# EAGLE design SArduino (EAGLE 9.6.2)
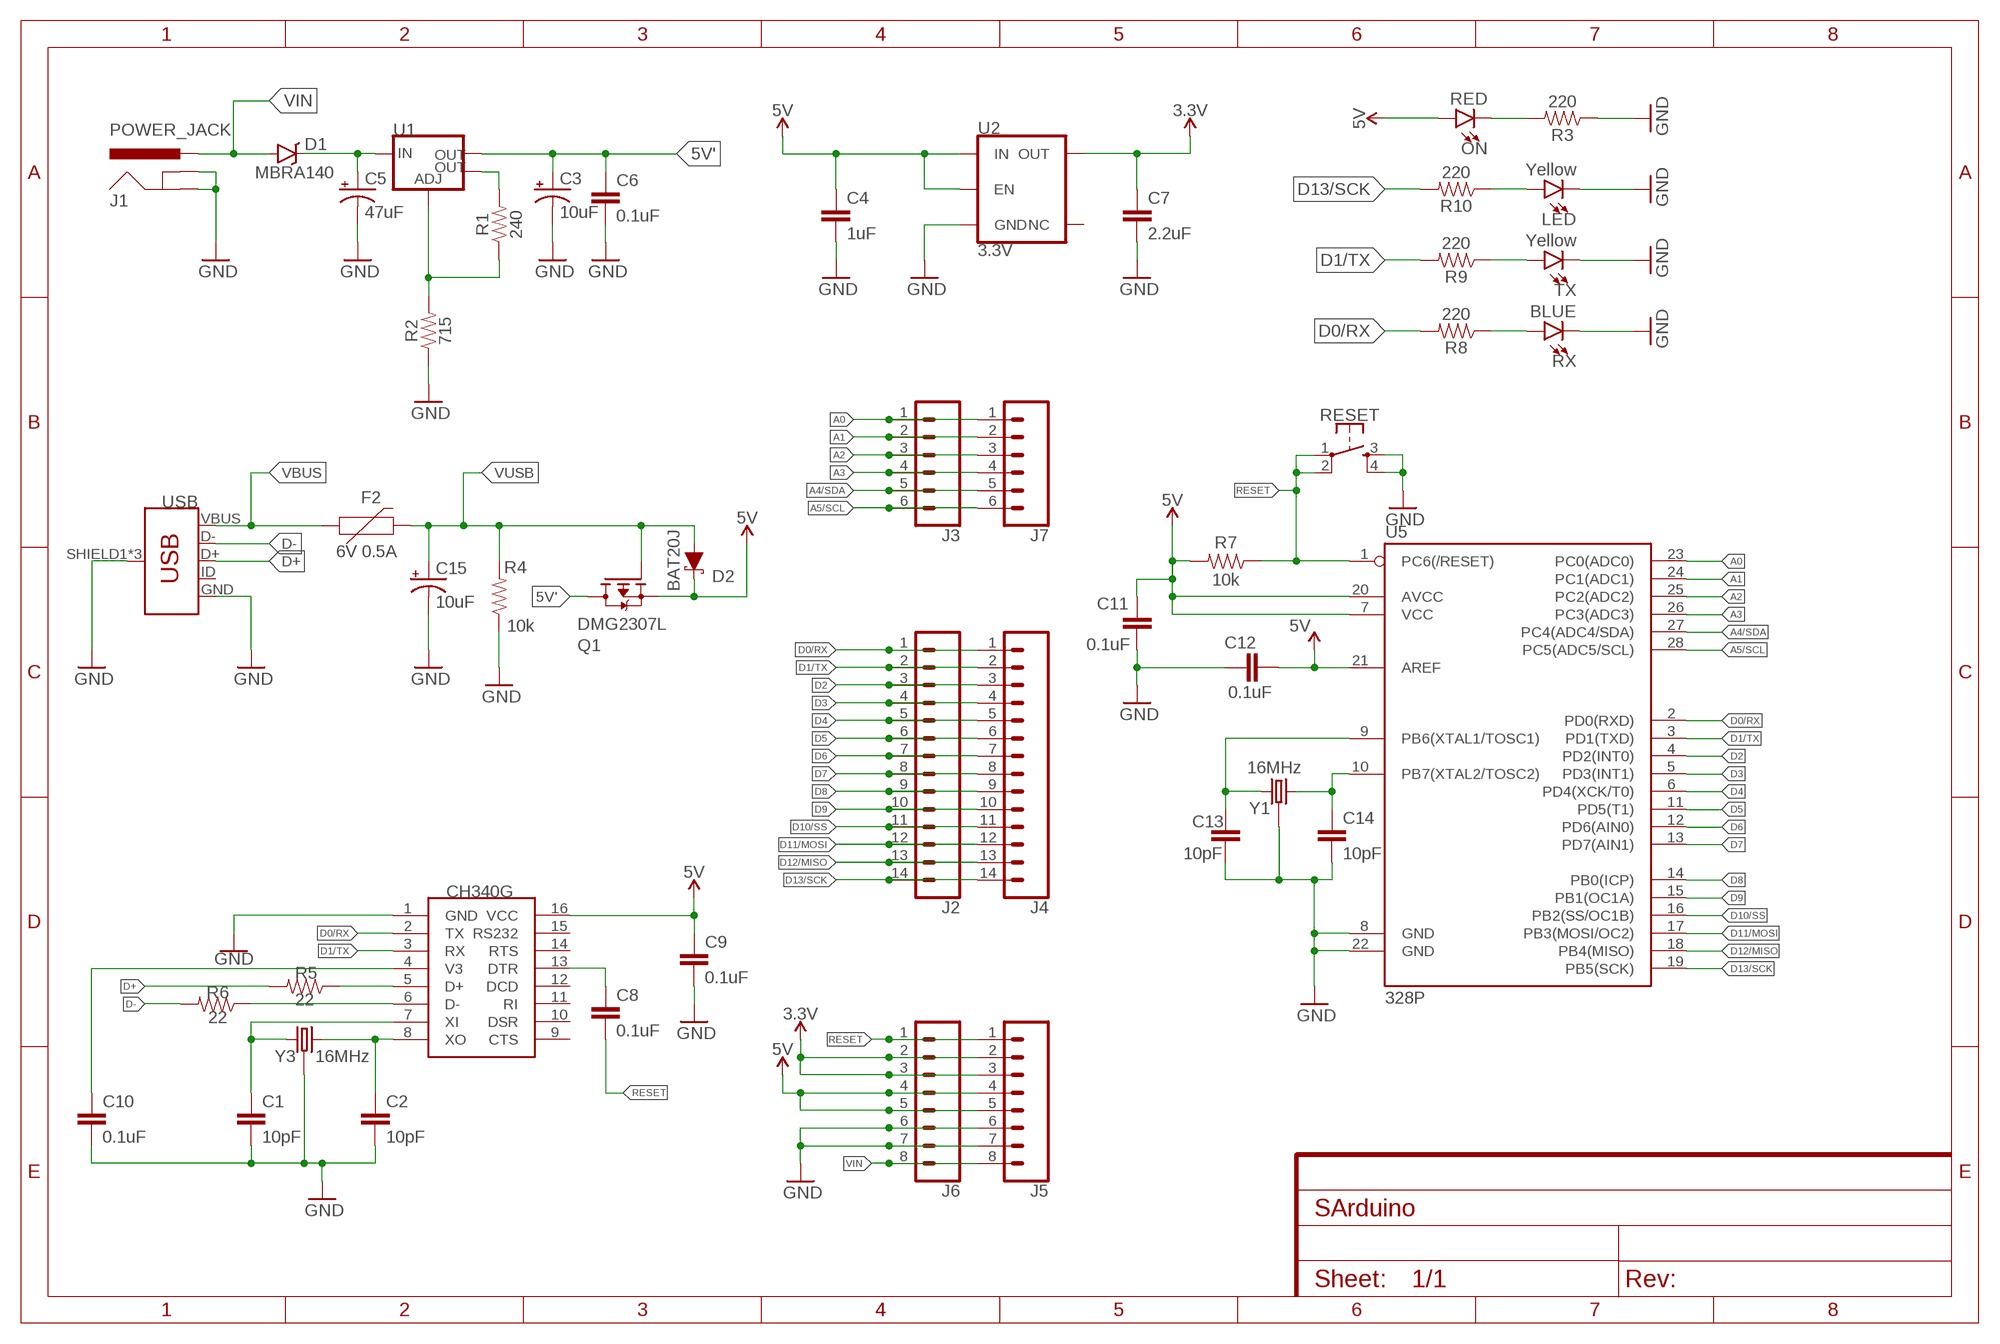
[diagram p0: schematic, sheet 1]

## Parts
C1  10pF  0.1UF-0603-25V-(+80/-20%)  [0603]
C2  10pF  0.1UF-0603-25V-(+80/-20%)  [0603]
C3  10uF  10UF-POLAR-EIA3216-16V-10%(TANT)  [EIA3216]
C4  1uF  0.1UF-0603-25V-(+80/-20%)  [0603]
C5  47uF  47UF-POLAR-PANASONIC_D-35V-20%  [PANASONIC_D]
C6  0.1uF  0.1UF-0603-25V-(+80/-20%)  [0603]
C7  2.2uF  0.1UF-0603-25V-(+80/-20%)  [0603]
C8  0.1uF  0.1UF-0603-25V-(+80/-20%)  [0603]
C9  0.1uF  0.1UF-0603-25V-(+80/-20%)  [0603]
C10  0.1uF  0.1UF-0603-25V-(+80/-20%)  [0603]
C11  0.1uF  0.1UF-0603-25V-(+80/-20%)  [0603]
C12  0.1uF  0.1UF-0603-25V-(+80/-20%)  [0603]
C13  10pF  0.1UF-0603-25V-(+80/-20%)  [0603]
C14  10pF  0.1UF-0603-25V-(+80/-20%)  [0603]
C15  10uF  10UF-POLAR-EIA3216-16V-10%(TANT)  [EIA3216]
D1  MBRA140  [SMA-DIODE@1]
D2  BAT20J  DIODE-SCHOTTKY-BAT20J  [SOD-323]
F2  6V 0.5A  PPTC_6V500MA  [0805]
J1  POWER_JACK  [POWER_JACK_PTH]
J2  CONN_14  [1X14]
J3  CONN_06SILK_FEMALE_PTH  [1X06]
J4  CONN_14  [1X14]
J5  CONN_08"  [1X08]
J6  CONN_08"  [1X08]
J7  CONN_06SILK_FEMALE_PTH  [1X06]
LED  Yellow  LED-YELLOW0603  [LED-0603]
ON  RED  LED-RED0603  [LED-0603]
Q1  DMG2307L  [SOT96P240X110-3N]
R1  240  240OHM-0603-1/10W-1%  [0603]
R2  715  715OHM-0603-1/10W-1%  [0603]
R3  220  240OHM-0603-1/10W-1%  [0603]
R4  10k  715OHM-0603-1/10W-1%  [0603]
R5  22  715OHM-0603-1/10W-1%  [0603]
R6  22  715OHM-0603-1/10W-1%  [0603]
R7  10k  715OHM-0603-1/10W-1%  [0603]
R8  220  240OHM-0603-1/10W-1%  [0603]
R9  220  240OHM-0603-1/10W-1%  [0603]
R10  220  240OHM-0603-1/10W-1%  [0603]
RESET  MOMENTARY-SWITCH-SPST-2-SMD-5.2MM  [TACTILE_SWITCH_SMD_5.2MM]
RX  BLUE  LED-BLUE0603  [LED-0603]
TX  Yellow  LED-YELLOW0603  [LED-0603]
U1  V_REG_LM1117SOT223  [SOT223]
U2  3.3V  V_REG_AP2112K-3.3V  [SOT23-5]
U3  CH340G  [SOIC16]
U5  328P  ATMEGA328P_PDIP  [DIP28]
USB  USB_MICRO-B_FEMALE-SMT  [USB-B-MICRO-SMD]
Y1  16MHz  CRYSTAL-GROUNDEDSMD-3.2X2.5  [CRYSTAL-SMD-3.2X2.5MM]
Y3  16MHz  CRYSTAL-GROUNDEDSMD-3.2X2.5  [CRYSTAL-SMD-3.2X2.5MM]

## Nets
3.3V: C7.1 J5.2 J5.3 J6.2 J6.3 U2.5(OUT)
5V: C4.1 C9.1 C11.2 C12.2 D2.C J5.4 J5.5 J6.4 J6.5 ON.A Q1.2(S) R7.2 U2.1(IN) U2.3(EN) U3.16(VCC) U5.7(VCC) U5.20(AVCC) U5.21(AREF)
5V': C3.+ C6.1 Q1.3(D) U1.2(OUT)
A0: J3.1 J7.1 U5.23(PC0(ADC0))
A1: J3.2 J7.2 U5.24(PC1(ADC1))
A2: J3.3 J7.3 U5.25(PC2(ADC2))
A3: J3.4 J7.4 U5.26(PC3(ADC3))
A4/SDA: J3.5 J7.5 U5.27(PC4(ADC4/SDA))
A5/SCL: J3.6 J7.6 U5.28(PC5(ADC5/SCL))
D0/RX: J2.1 J4.1 R8.2 U3.2(TX) U5.2(PD0(RXD))
D1/TX: J2.2 J4.2 R9.2 U3.3(RX) U5.3(PD1(TXD))
D2: J2.3 J4.3 U5.4(PD2(INT0))
D3: J2.4 J4.4 U5.5(PD3(INT1))
D4: J2.5 J4.5 U5.6(PD4(XCK/T0))
D5: J2.6 J4.6 U5.11(PD5(T1))
D6: J2.7 J4.7 U5.12(PD6(AIN0))
D7: J2.8 J4.8 U5.13(PD7(AIN1))
D8: J2.9 J4.9 U5.14(PB0(ICP))
D9: J2.10 J4.10 U5.15(PB1(OC1A))
D10/SS: J2.11 J4.11 U5.16(PB2(SS/OC1B))
D11/MOSI: J2.12 J4.12 U5.17(PB3(MOSI/OC2))
D12/MISO: J2.13 J4.13 U5.18(PB4(MISO))
D13/SCK: J2.14 J4.14 R10.2 U5.19(PB5(SCK))
D+: R5.2 USB.D+
D-: R6.2 USB.D-
GND: C1.2 C2.2 C3.- C4.2 C5.- C6.2 C7.2 C9.2 C10.2 C11.1 C12.1 C13.2 C14.2 C15.- J1.GND J1.GNDBREAK J5.6 J5.7 J6.6 J6.7 LED.C R2.1 R3.1 R4.1 RESET.3 RESET.4 RX.C TX.C U2.2(GND) U3.1(GND) U5.8(GND) U5.22(GND) USB.GND USB.SHIELD1(SHIELD) USB.SHIELD2(SHIELD) USB.SHIELD3(SHIELD) Y1.2(GND) Y1.4(GND) Y3.2(GND) Y3.4(GND)
N$1: C5.+ D1.C U1.3(IN)
N$3: ON.C R3.2
N$4: R8.1 RX.A
N$5: R9.1 TX.A
N$6: LED.A R10.1
N$7: R5.1 U3.5(D+)
N$8: R6.1 U3.6(D-)
N$9: C2.1 U3.8(XO) Y3.3
N$10: C13.1 U5.9(PB6(XTAL1/TOSC1)) Y1.1
N$11: C1.1 U3.7(XI) Y3.1
N$12: C10.1 U3.4(V3)
N$13: C14.1 U5.10(PB7(XTAL2/TOSC2)) Y1.3
N$14: R1.2 U1.4(OUT)
N$15: R1.1 R2.2 U1.1(ADJ)
N$17: C8.1 U3.13(DTR)
RESET: C8.2 J5.1 J6.1 R7.1 RESET.1 RESET.2 U5.1(PC6(/RESET))
VBUS: F2.1 USB.VBUS
VIN: D1.A J1.PWR J5.8 J6.8
VUSB: C15.+ D2.A F2.2 Q1.1(G) R4.2
Unconnected: U2.4(NC) U3.9(CTS) U3.10(DSR) U3.11(RI) U3.12(DCD) U3.14(RTS) U3.15(RS232) USB.ID

## Library data of the parts
C1 C2 C4 C7 C13 C14 = SparkFun-Capacitors:0.1UF: 0.1µF ceramic capacitors A capacitor is a passive two-terminal electrical component used to store electrical energy temporarily in an electric field.; PROD_ID: CAP-00810; VALUE: 0.1uF
C3 C15 = SparkFun-Capacitors:10UF-POLAR: 10.0µF polarized capacitors A capacitor is a passive two-terminal electrical component used to store electrical energy temporarily in an electric field.; PROD_ID: CAP-00811
C5 = SparkFun-Capacitors:47UF-POLAR: 47µF polarized capacitors A capacitor is a passive two-terminal electrical component used to store electrical energy temporarily in an electric field.; PROD_ID: CAP-08478
C6 C8-C12 = SparkFun-Capacitors:0.1UF: 0.1µF ceramic capacitors A capacitor is a passive two-terminal electrical component used to store electrical energy temporarily in an electric field.; PROD_ID: CAP-00810
D1 = SparkFun-DiscreteSemi:MBRA140: 40V, 1A Schottky rectifier SMA/DO-214AC package DIO-08053; PROD_ID: DIO-08053
D2 = SparkFun-DiscreteSemi:DIODE-SCHOTTKY: Schottky diode A Schottky diode is a semiconductor diode which has a low forward voltage drop and a very fast switching action.; PROD_ID: DIO-11623; VALUE: 1A/23V/620mV
F2 = SparkFun-Fuses:PPTC: Resettable Fuse PPTC Resettable Fuse. Really a sort of resistor with a polymeric positive temperature coefficient whose resistance increases dramatically with an increase in temperature. When heated by the power passing through the resistance rises causing the current to be limited, protecting the circuit. This is achieved by the transition of the polymer from a crystalline to an amorphous state where the conductive carbon separates breaking the conductive pathways found in the cool crystalline structure. When a PPTC cools back down it resumes conducting letting the circuit turn back on. SparkFun Products: SparkFun RedBoard - Programmed with Arduino <https://www.sparkfun.com/products/12757> Pro Micro - 5V/16MHz <https://www.sparkfun.com/products/12640> Arduino Pro 328 - 5V/16MHz <https://www.sparkfun.com/products/10915> MP3 Trigger <https://www.sparkfun.com/products/13720>; PROD_ID: RES-13945
J1 = SparkFun-Connectors:POWER_JACK: Power Jack Connector This is the standard 5.5mm barrel jack for power. The PTH is the most common, proven, reliable, footprint. The Slot footprint only works if the mill layer is transmitted to the PCB fab house so be warned. Here are the connectors we sell at SparkFun: DC Barrel Power Jack/Connector <https://www.sparkfun.com/products/119> (PRT-00119) DC Barrel Power Jack/Connector (SMD) <https://www.sparkfun.com/products/12748> (PRT-12748) DC Barrel Jack Adapter - Breadboard Compatible <https://www.sparkfun.com/products/10811> (PRT-10811) It is used on this SparkFun product (and many, many others): SparkFun RedBoard - Programmed with Arduino <https://www.sparkfun.com/products/12757> (DEV-12757) Also, if you need a mating power supply or connector, please check these out: Wall Adapter Power Supply - 9VDC 650mA <https://www.sparkfun.com/products/298> (TOL-00298) DC Barrel Jack Adapter - Male <https://www.sparkfun.com/products/10287> (PRT-10287); PROD_ID: CONN-08197
J2 J4 = SparkFun-Connectors:CONN_14: Multi connection point. Often used as Generic Header-pin footprint for 0.1 inch spaced/style header connections On any of the 0.1 inch spaced packages, you can populate with these: Break Away Headers - Straight <https://www.sparkfun.com/products/116> (PRT-00116) Break Away Male Headers - Right Angle <https://www.sparkfun.com/products/553> (PRT-00553) Female Headers <https://www.sparkfun.com/products/115> (PRT-00115) Break Away Headers - Machine Pin <https://www.sparkfun.com/products/117> (PRT-00117) Break Away Female Headers - Swiss Machine Pin <https://www.sparkfun.com/products/743> (PRT-00743) For SCREWTERMINALS and SPRING TERMINALS visit here: Screw Terimnals on SparkFun.com <https://www.sparkfun.com/search/results?term=Screw+Terminals> (5mm/3.5mm/2.54mm spacing) This device is also useful as a general connection point to wire up your design to another part of your project. Our various solder wires solder well into these plated through hole pads. Hook-Up Wire - Assortment (Stranded, 22 AWG) <https://www.sparkfun.com/products/11375> (PRT-11375) Hook-Up Wire - Assortment (Solid Core, 22 AWG) <https://www.sparkfun.com/products/11367> (PRT-11367) View the entire wire category on our website here <https://www.sparkfun.com/categories/141> Special notes: Molex polarized connector foot print use with SKU : PRT-08231 with associated crimp pins and housings. 1MM SMD Version SKU: PRT-10208 NOTES ON THE VARIANTS LOCK and LOCK_LONGPADS... This footprint was designed to help hold the alignment of a through-hole component (i.e. 6-pin header) while soldering it into place. You may notice that each hole has been shifted either up or down by 0.005 of an inch from it's more standard position (which is a perfectly straight line). This slight alteration caused the pins (the squares in the middle) to touch the edges of the holes. Because they are alternating, it causes a "brace" to hold the component in place. 0.005 has proven to be the perfect amount of "off-center" position when using our standard breakaway headers. Although looks a little odd when you look at the bare footprint, once you have a header in there, the alteration is very hard to notice. Also,if you push a header all the way into place, it is covered up entirely on the bottom side.
J3 J7 = SparkFun-Connectors:CONN_06: Multi connection point. Often used as Generic Header-pin footprint for 0.1 inch spaced/style header connections On any of the 0.1 inch spaced packages, you can populate with these: Break Away Headers - Straight <https://www.sparkfun.com/products/116> (PRT-00116) Break Away Male Headers - Right Angle <https://www.sparkfun.com/products/553> (PRT-00553) Female Headers <https://www.sparkfun.com/products/115> (PRT-00115) Break Away Headers - Machine Pin <https://www.sparkfun.com/products/117> (PRT-00117) Break Away Female Headers - Swiss Machine Pin <https://www.sparkfun.com/products/743> (PRT-00743) Arduino Stackable Header - 6 Pin <https://www.sparkfun.com/products/9280> (PRT-09280) For SCREWTERMINALS and SPRING TERMINALS visit here: Screw Terimnals on SparkFun.com <https://www.sparkfun.com/search/results?term=Screw+Terminals> (5mm/3.5mm/2.54mm spacing) This device is also useful as a general connection point to wire up your design to another part of your project. Our various solder wires solder well into these plated through hole pads. Hook-Up Wire - Assortment (Stranded, 22 AWG) <https://www.sparkfun.com/products/11375> (PRT-11375) Hook-Up Wire - Assortment (Solid Core, 22 AWG) <https://www.sparkfun.com/products/11367> (PRT-11367) View the entire wire category on our website here <https://www.sparkfun.com/categories/141>; PROD_ID: CONN-08437
J5 J6 = SparkFun-Connectors:CONN_08: Multi connection point. Often used as Generic Header-pin footprint for 0.1 inch spaced/style header connections On any of the 0.1 inch spaced packages, you can populate with these: Break Away Headers - Straight <https://www.sparkfun.com/products/116> (PRT-00116) Break Away Male Headers - Right Angle <https://www.sparkfun.com/products/553> (PRT-00553) Female Headers <https://www.sparkfun.com/products/115> (PRT-00115) Break Away Headers - Machine Pin <https://www.sparkfun.com/products/117> (PRT-00117) Break Away Female Headers - Swiss Machine Pin <https://www.sparkfun.com/products/743> (PRT-00743) Arduino Stackable Header - 8 Pin <https://www.sparkfun.com/products/9279> (PRT-09279) For SCREWTERMINALS and SPRING TERMINALS visit here: Screw Terimnals on SparkFun.com <https://www.sparkfun.com/search/results?term=Screw+Terminals> (5mm/3.5mm/2.54mm spacing) This device is also useful as a general connection point to wire up your design to another part of your project. Our various solder wires solder well into these plated through hole pads. Hook-Up Wire - Assortment (Stranded, 22 AWG) <https://www.sparkfun.com/products/11375> (PRT-11375) Hook-Up Wire - Assortment (Solid Core, 22 AWG) <https://www.sparkfun.com/products/11367> (PRT-11367) View the entire wire category on our website here <https://www.sparkfun.com/categories/141> Special notes: Molex polarized connector foot print use with SKU : PRT-08231 with associated crimp pins and housings. 1MM SMD Version SKU: PRT-10208 NOTES ON THE VARIANTS LOCK and LOCK_LONGPADS... This footprint was designed to help hold the alignment of a through-hole component (i.e. 6-pin header) while soldering it into place. You may notice that each hole has been shifted either up or down by 0.005 of an inch from it's more standard position (which is a perfectly straight line). This slight alteration caused the pins (the squares in the middle) to touch the edges of the holes. Because they are alternating, it causes a "brace" to hold the component in place. 0.005 has proven to be the perfect amount of "off-center" position when using our standard breakaway headers. Although looks a little odd when you look at the bare footprint, once you have a header in there, the alteration is very hard to notice. Also,if you push a header all the way into place, it is covered up entirely on the bottom side.; PROD_ID: CONN-08438
LED TX = SparkFun-LED:LED-YELLOW: Yellow SMD LED Used in manufacturing several products at SparkFun. Packages: 0603 - SMD 0603 package[Product Link] <http://www.kingbrightusa.com/product.asp?catalog_name=LED&product_id=APT1608SYCK> 0603 -SMART - SMART SMD 0603 package (more efficient/more expensive) [Product Link] <http://www.osram-os.com/osram_os/en/products/product-catalog/led-light-emitting-diodes/smartled-0603/ly-l29k/index.jsp> LilyPad - SMD1206 package[Product Datasheet] <https://www.sparkfun.com/datasheets/DevTools/LilyPad/Q150YUS4.pdf> SparkFun Products: Blynk Board <https://www.sparkfun.com/products/13794> IOIO-OTG <https://www.sparkfun.com/products/13613> XBee Explorer Serial <https://www.sparkfun.com/products/13225>; PROD_ID: DIO-09003
ON = SparkFun-LED:LED-RED: Red SMD LED Used in manufacturing of most products at SparkFun Packages: 0603 - SMD 0603 package [Product Link] <http://docs.avagotech.com/docs/AV02-0551EN> 0603 SMART - SMD 0603 SMART package ( more efficient and expensive)[Product Link] <http://www.osram-os.com/Graphics/XPic2/00077099_0.pdf> 1206 - SMD1206 package [Product Link] <https://www.sparkfun.com/datasheets/DevTools/LilyPad/Q150OVS4.pdff> SparkFun Products: Pro Mini 328 -5V <https://www.sparkfun.com/products/821> RedBoard <https://www.sparkfun.com/products/12757> IOIO-OTG <https://www.sparkfun.com/products/13613>; PROD_ID: DIO-00819
Q1 = DMG2307L:DMG2307L: MOSFET, P CH, 30V, 3.8A, SOT23; Transistor Polarity: P Channel; Continuous Drain Current Id: -4.6A; Drain Source Volt...; AVAILABILITY: Unavailable; DESCRIPTION: P-Channel 30V 2.5A (Ta) 760mW (Ta) Surface Mount SOT-23; MF: Diodes Inc.; MP: DMG2307L; PACKAGE: SOT-23-3 Diodes Inc.; PRICE: None
R1 = SparkFun-Resistors:240OHM: 240Ω resistor A resistor is a passive two-terminal electrical component that implements electrical resistance as a circuit element. Resistors act to reduce current flow, and, at the same time, act to lower voltage levels within circuits.; PROD_ID: RES-07849
R2 = SparkFun-Resistors:715OHM: 715Ω resistor A resistor is a passive two-terminal electrical component that implements electrical resistance as a circuit element. Resistors act to reduce current flow, and, at the same time, act to lower voltage levels within circuits.; PROD_ID: RES-07850
R3 R8-R10 = SparkFun-Resistors:240OHM: 240Ω resistor A resistor is a passive two-terminal electrical component that implements electrical resistance as a circuit element. Resistors act to reduce current flow, and, at the same time, act to lower voltage levels within circuits.; PROD_ID: RES-07849; VALUE: 240
R4-R7 = SparkFun-Resistors:715OHM: 715Ω resistor A resistor is a passive two-terminal electrical component that implements electrical resistance as a circuit element. Resistors act to reduce current flow, and, at the same time, act to lower voltage levels within circuits.; PROD_ID: RES-07850; VALUE: 715
RESET = SparkFun-Switches:MOMENTARY-SWITCH-SPST-2: Momentary Switch (Pushbutton) - SPST - Two Circuits Normally-open (NO) SPST momentary switches (buttons, pushbuttons). Schematic symbol includes two switch circuits. Variants SMD-4.6MMX2.8MM - 4.60mm x 2.80mm Tactile Momentary Button Switch - Used on SparkFun SAMD21 Mini Breakout <https://www.sparkfun.com/products/13664> SMD-5.2MM - Mini Pushbutton Switch - SMD <https://www.sparkfun.com/products/8720> - Used on Arduino Pro Mini <https://www.sparkfun.com/products/11114>; PROD_ID: SWCH-08247; SF_SKU: COM-08720
RX = SparkFun-LED:LED-BLUE: Blue SMD LED Used in manufacturing of various products at SparkFun Packages: 0603 - SMD 0603 package [Product Link] <http://www.digikey.com/product-detail/en/SMLE12BC7TT86/511-1589-2-ND/1641808> 1206 - SMD1206 package [Product Link] <http://www.digikey.com/product-detail/en/lite-on-inc/LTST-C150TBKT/160-1643-1-ND/573584> SparkFun Products: ESP8266 Thing-Dev Board <https://www.sparkfun.com/products/13711> RedBoard <https://www.sparkfun.com/products/12757>; PROD_ID: DIO-08575
U1 = SparkFun-IC-Power:V_REG_LM1117: Voltage Regulator LM1117 Standard adjustable voltage regulator but in SMD form. Spark Fun Electronics SKU : COM-00595; PROD_ID: VREG-08170
U2 = SparkFun-IC-Power:V_REG_AP2112: AP2112 - 600mA CMOS LDO Regulator w/ Enable The AP2112 is CMOS process low dropout linear regulator with enable function, the regulator delivers a guaranteed 600mA (min.) continuous load current. Features Output Voltage Accuracy: ±1.5% Output Current: 600mA (Min.) Foldback Short Current Protection: 50mA Enable Function to Turn ON/OFF VOUT Low Dropout Voltage (3.3V): 250mV (Typ.) @IOUT=600mA Excellent Load Regulation: 0.2%/A (Typ.) Excellent Line Regulation: 0.02%/V (Typ.) Low Quiescent Current: 55μA (Typ.) Low Standby Current: 0.01μA (Typ.) Low Output Noise: 50μVRMS PSRR: 100Hz -65dB, 1kHz -65dB OTSD Protection Stable with 1.0μF Flexible Cap: Ceramic, Tantalum and Aluminum Electrolytic Operation Temperature Range: -40°C to 85°C ESD: MM 400V, HBM 4000V; PROD_ID: VREG-12457
U3 = ch340g:CH340G
U5 = SparkFun-IC-Microcontroller:ATMEGA328P_PDIP: Atmel 328P Through hole ATMEGA328P uC used in the Arduino 32kb flash, 1k EEPROM, 2k SRAM Datasheet <http://www.sparkfun.com/datasheets/Components/SMD/ATMega328.pdf> SparkFun Products Storefront component: AVR 28 Pin 20MHz 32K 6A/D - ATMega328P <https://www.sparkfun.com/products/9061> (COM-09061) SparkFun Simon Says - Through-Hole Soldering Kit <https://www.sparkfun.com/products/10547> (KIT-10547) SparkFun Learn to Solder - Simon Says <https://www.sparkfun.com/products/13708> (KIT-13708) SparkFun BigTime Watch Kit <https://www.sparkfun.com/products/11734> (KIT-11734) SparkFun ClockIt <https://www.sparkfun.com/products/10930> (KIT-10930) SparkFun Serial Enabled LCD Kit <https://www.sparkfun.com/products/10097> (LCD-10097) SparkFun Simon Tilts - Through Hole Soldering Kit <https://www.sparkfun.com/products/12634> (KIT-12634) SparkFun Frequency Counter Kit <https://www.sparkfun.com/products/10140> (KIT-10140) FabFM Radio Kit <https://www.sparkfun.com/products/11043> (KIT-11043) SparkFun Binary Blaster Kit <https://www.sparkfun.com/products/12037> (KIT-12037) SparkFun Metro-Gnome <https://www.sparkfun.com/products/9236> (KIT-09236) ATmega328 with Arduino Optiboot (Uno) <https://www.sparkfun.com/products/10524> (DEV-10524); PROD_ID: IC-09136
USB = SparkFun-Connectors:USB_MICRO-B: USB Type Micro-B Connector Male/female and PTH/SMT variants SparkFun Products: SparkFun microB USB Breakout <https://www.sparkfun.com/products/12035> SparkFun USB microB Plug Breakout <https://www.sparkfun.com/products/10031> SparkFun ESP8266 Thing <https://www.sparkfun.com/products/13231>; PROD_ID: CONN-11752
Y1 Y3 = SparkFun-Clocks:CRYSTAL-GROUNDED: Crystals w/ Ground Pin (Generic) These are passive quartz crystals, which can be used as a clock source for a microcontroller. Crystal's are usually two-terminal devices. A third terminal may be optionally connected to ground, as recommended by the manufaturer.

## Net classes
0 default: width 0.152 mm, drill 0.305 mm, clearance 0.152 mm

## Board
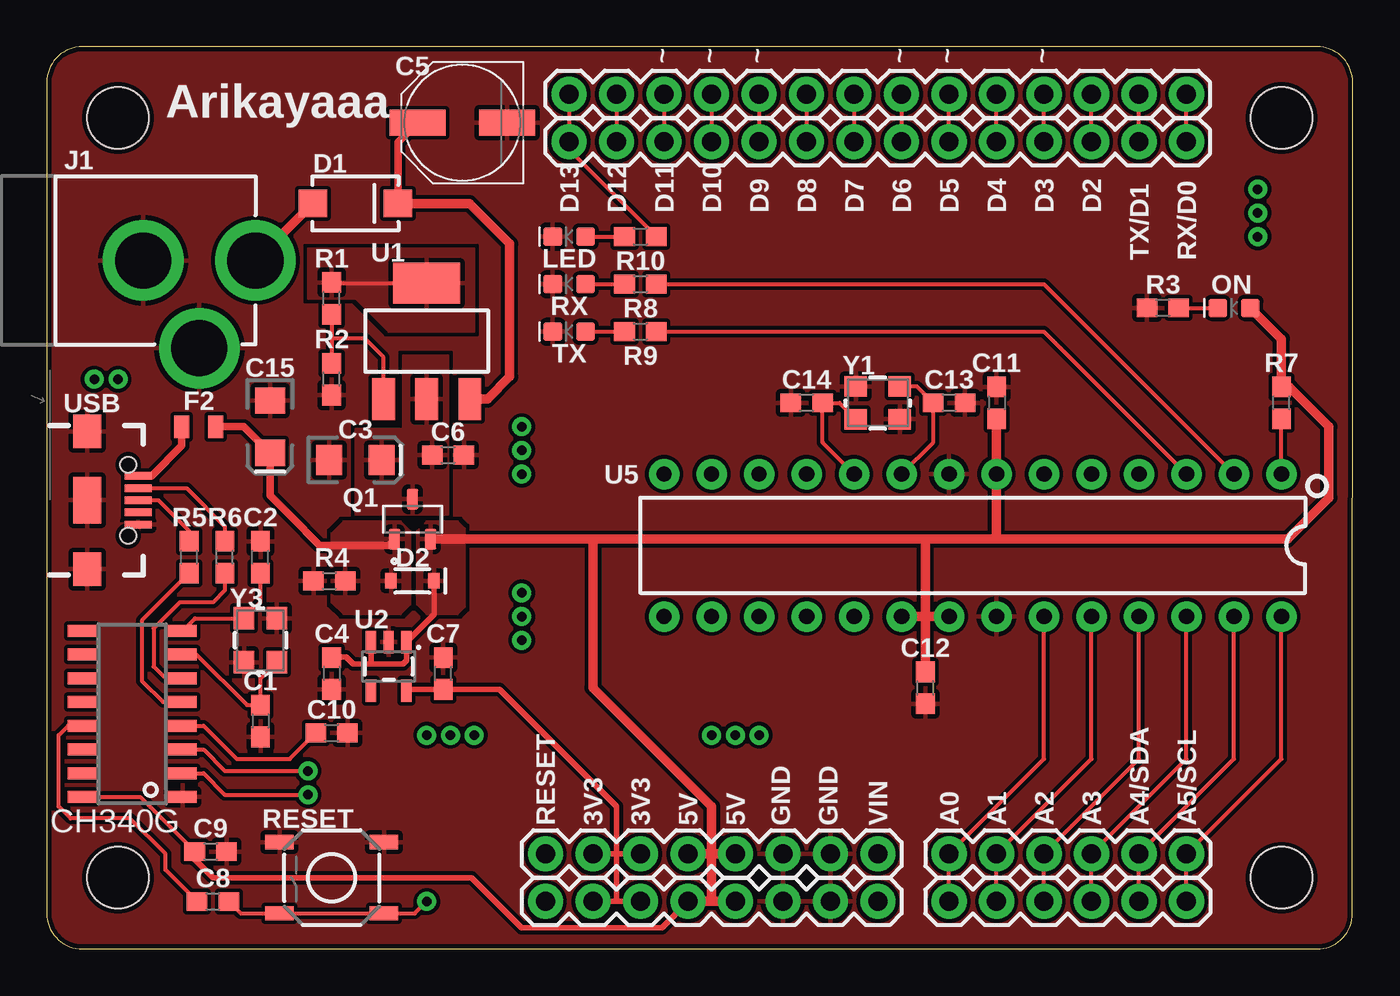
[diagram p1: board, top side]
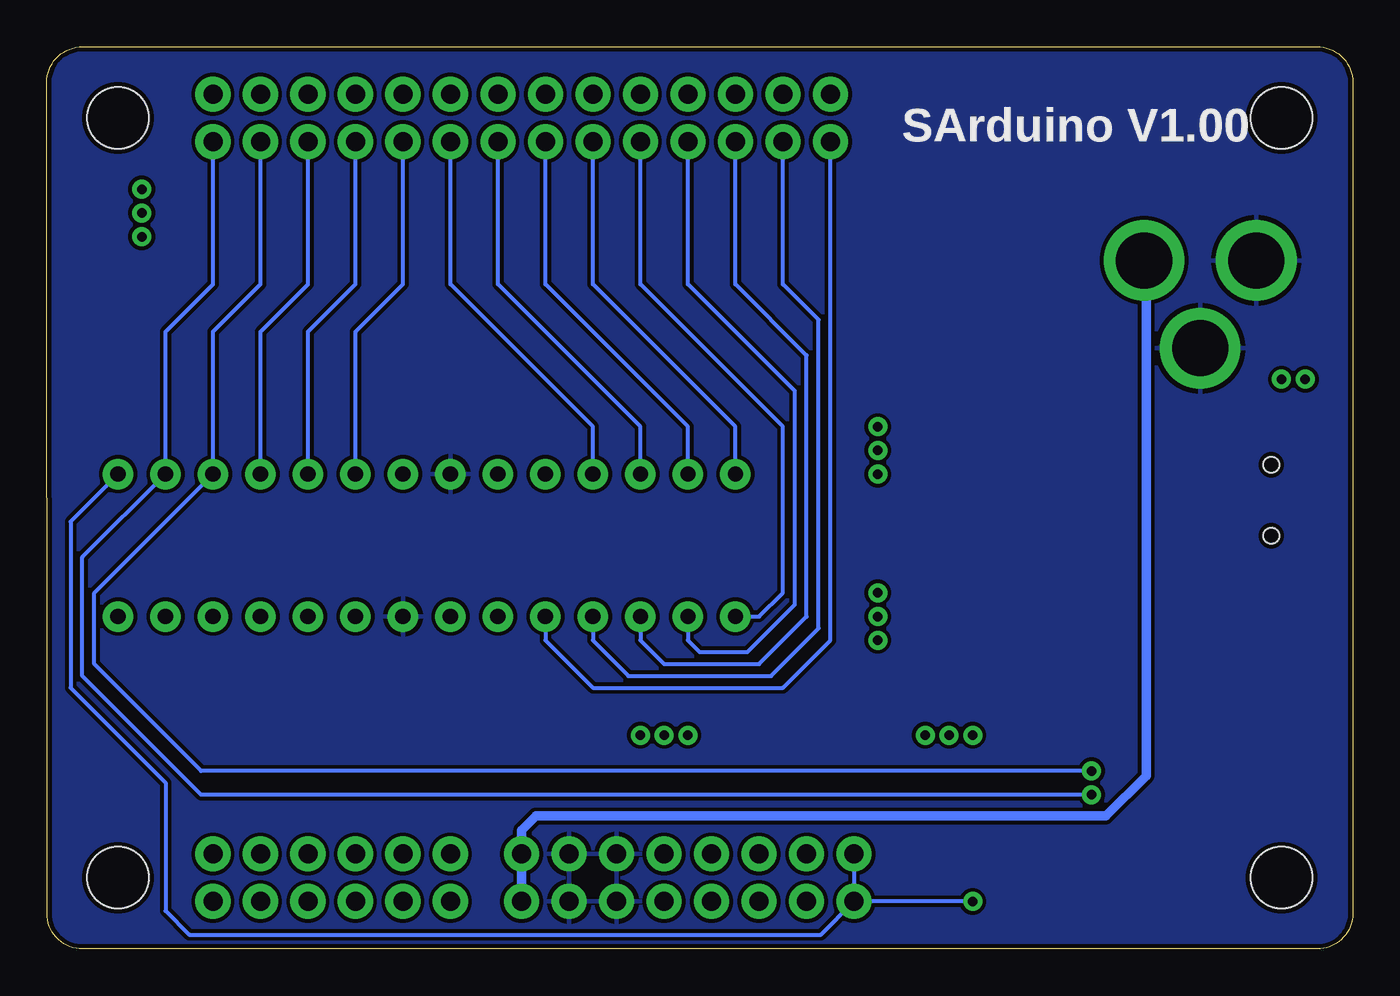
[diagram p2: board, bottom side, seen from below]

Size 69.85 x 48.26 mm. Coordinates in mm from the lower left corner, seen from the top.
Outline: 0,46.35 0,1.91 arc90 1.91,0 67.93,0 arc90 69.83,1.91 69.85,46.35 arc90 67.94,48.26 1.91,48.26 arc90 0,46.35
Copper layers (1*16): Top 0.035mm / dielectric 1.5mm / Bottom 0.035mm
Design rules "SparkFun": minimum track width 8mil, minimum drill 20mil, track to track 8mil, track to pad 8mil, pad to pad 8mil, via to via 8mil, smd to smd 8mil, copper to edge 10mil, drill to drill 8mil, minimum pad ring 12mil, minimum via ring 10mil, stop-mask expansion 4mil, vias tented up to drill 25mil, thermal gap 10mil
Holes 3.3 mm at 3.81,44.45 3.81,3.81 66.04,3.81 66.04,44.45

### Footprints (pad centres in the part's own frame; a part is rotated, then mirrored left to right if it is on the bottom)
0603 = smd 1.1 x 1: 1 -0.85,0; 2 0.85,0
EIA3216 = smd 1.4 x 1.6: + 1.4,0; - -1.4,0
PANASONIC_D = smd 3 x 1.4: + 2.4,0; - -2.4,0
SMA-DIODE@1 = smd 1.524 x 1.47: A -2.277,0; C 2.277,0
SOD-323 = smd 0.63 x 0.83: A 1.15,0; C -1.15,0
0805 = smd 0.8 x 1.2: 1 -0.9,0; 2 0.9,0
POWER_JACK_PTH = drill 2.997 pad 4.318: GND 0,7.7; GNDBREAK 4.7,10.7; PWR 0,13.7
1X14 = drill 1.016 pad 1.88: 1 0,0; 2 2.54,0; 3 5.08,0; 4 7.62,0; 5 10.16,0; 6 12.7,0; 7 15.24,0; 8 17.78,0; 9 20.32,0; 10 22.86,0; 11 25.4,0; 12 27.94,0; 13 30.48,0; 14 33.02,0
1X06 = drill 1.016 pad 1.88: 1 0,0; 2 2.54,0; 3 5.08,0; 4 7.62,0; 5 10.16,0; 6 12.7,0
1X08 = drill 1.016 pad 1.88: 1 0,0; 2 2.54,0; 3 5.08,0; 4 7.62,0; 5 10.16,0; 6 12.7,0; 7 15.24,0; 8 17.78,0
LED-0603 = smd 1 x 1: A -0.877,0; C 0.877,0
SOT96P240X110-3N = smd 1.09 x 0.61: 1 -1.07,0.96; 2 -1.07,-0.96; 3 1.07,0
TACTILE_SWITCH_SMD_5.2MM = smd 1.524 x 0.762: 1 -2.794,1.905; 2 2.794,1.905; 3 -2.794,-1.905; 4 2.794,-1.905
SOT223 = smd 1.219 x 2.235: 1 -2.311,-3.099; 2 0,-3.099; 3 2.311,-3.099 | smd 3.6 x 2.2: 4 0,3.099
SOT23-5 = smd 0.55 x 1.2: 1 -0.95,-1.3; 2 0,-1.3; 3 0.95,-1.3; 4 0.95,1.3; 5 -0.95,1.3
SOIC16 = smd 0.635 x 1.524: 1 -4.445,-2.695; 2 -3.175,-2.695; 3 -1.905,-2.695; 4 -0.635,-2.695; 5 0.635,-2.695; 6 1.905,-2.695; 7 3.175,-2.695; 8 4.445,-2.695; 9 4.445,2.695; 10 3.175,2.695; 11 1.905,2.695; 12 0.635,2.695; 13 -0.635,2.695; 14 -1.905,2.695; 15 -3.175,2.695; 16 -4.445,2.695
DIP28 = drill 0.813 pad 1.626: 1 -16.51,-3.81; 2 -13.97,-3.81; 3 -11.43,-3.81; 4 -8.89,-3.81; 5 -6.35,-3.81; 6 -3.81,-3.81; 7 -1.27,-3.81; 8 1.27,-3.81; 9 3.81,-3.81; 10 6.35,-3.81; 11 8.89,-3.81; 12 11.43,-3.81; 13 13.97,-3.81; 14 16.51,-3.81; 15 16.51,3.81; 16 13.97,3.81; 17 11.43,3.81; 18 8.89,3.81; 19 6.35,3.81; 20 3.81,3.81; 21 1.27,3.81; 22 -1.27,3.81; 23 -3.81,3.81; 24 -6.35,3.81; 25 -8.89,3.81; 26 -11.43,3.81; 27 -13.97,3.81; 28 -16.51,3.81
USB-B-MICRO-SMD = smd 1.45 x 0.4: D+ 2.725,0; D- 2.725,0.65; GND 2.725,-1.3; ID 2.725,-0.65; VBUS 2.725,1.3 | smd 1.5 x 1.8: SHIELD1 0,3.685; SHIELD2 0,-3.685 | smd 1.5 x 2.5: SHIELD3 0,0 | hole 0.85: 2.2,1.9; 2.2,-1.9
CRYSTAL-SMD-3.2X2.5MM = smd 1.2 x 1.1: 1 -1.175,-0.875; 2 1.175,-0.875; 3 1.175,0.875; 4 -1.175,0.875

### Placement (x,y rotation side)
C1  11.43,12.19 270 top
C2  11.43,20.95 90 top
C3  16.51,26.16 0 top
C4  15.24,14.73 270 top
C5  22.23,44.2 180 top
C6  21.46,26.42 0 top
C7  21.21,14.73 90 top
C8  8.89,2.54 0 top
C9  8.76,5.21 0 top
C10  15.24,11.56 0 top
C11  50.8,29.21 270 top
C12  46.99,13.97 90 top
C13  48.26,29.21 0 top
C14  40.64,29.21 180 top
C15  11.94,27.94 270 top
D1  16.51,39.88 0 top
D2  19.56,19.68 180 top
F2  8.13,27.94 0 top
J1  -2.54,36.83 270 top
J2  60.96,43.18 180 top
J3  48.26,5.08 0 top
J4  60.96,45.72 180 top
J5  26.67,2.54 0 top
J6  26.67,5.08 0 top
J7  48.26,2.54 0 top
LED  27.94,38.1 180 top
ON  63.5,34.29 180 top
Q1  19.56,22.99 90 top
R1  15.24,34.8 90 top
R2  15.24,30.48 90 top
R3  59.69,34.29 0 top
R4  15.11,19.68 0 top
R5  7.62,20.95 90 top
R6  9.53,20.95 90 top
R7  66.04,29.21 90 top
R8  31.75,35.56 0 top
R9  31.75,33.02 0 top
R10  31.75,38.1 0 top
RESET  15.24,3.81 180 top
RX  27.94,35.56 180 top
TX  27.94,33.02 180 top
U1  20.32,32.51 0 top
U2  18.29,15.11 180 top
U3  4.57,12.57 90 top
U5  49.53,21.59 180 top
USB  2.16,24 0 top
Y1  44.45,29.21 180 top
Y3  11.43,16.51 90 top

### Tracks (layer width: path | path; a pad name or v marks a point on that pad's centre or on a via)
3.3V
  Top 0.305: U2.5 19.31,13.88 C7.1 24.22,13.88 30.48,7.62 30.48,5.08 | 30.48,2.54 J5.2 J5.3 30.48,2.54 | J6.2 30.48,5.08 | 30.48,5.08 J6.3 | 30.48,2.54 30.48,5.08
5V
  Top 0.203: U3.16 4.99,8.13 7.83,5.29 C9.1
  Top 0.305: 17.27,15.24 19.05,15.24 19.24,15.43 U2.1 20.71,17.88 D2.C | 17.27,15.24 16.38,15.24 16,15.62 15.28,15.62 C4.1 | U2.3 17.34,15.31 17.27,15.24 | J5.4 32.89,1.14 25.4,1.14 22.73,3.81 8.89,3.81 7.83,4.87 | 66.46,30.06 R7.2
  Top 0.406: 7.83,4.87 7.83,5.29
  Top 0.508: Q1.2 29.21,21.92 | 29.21,21.92 46.99,21.92 | 46.99,21.92 50.75,21.92 | 50.75,21.92 50.8,21.97 U5.7 C11.2 | U5.20 46.99,17.78 | U5.21 46.99,17.78 | C12.2 46.99,17.78 | 46.99,17.78 46.99,21.92 | 35.56,5.08 35.56,7.62 29.21,13.97 29.21,21.92 | 35.56,5.08 35.56,2.54 | 35.56,2.54 J5.4 | J5.5 35.56,2.54 | J6.5 35.56,5.08 | J6.4 35.56,5.08 | 50.75,21.92 66.37,21.92 68.58,24.13 68.58,27.94 66.46,30.06 | ON.A 66.04,32.63 R7.2
  pour Top: 20.32,22.86 19.81,22.35 19.81,18.41 20.32,17.91 21.97,17.91 22.35,18.29 22.35,22.48 21.97,22.86
5V'
  pour Top: 19.05,31.75 19.05,27.81 16.51,27.81 16.51,23.24 21.46,23.24 21.46,31.75
A0
  Top 0.203: J7.1 J3.1 53.34,10.16 U5.23
A1
  Top 0.203: J7.2 J3.2 55.88,10.16 U5.24
A2
  Top 0.203: J7.3 J3.3 58.42,10.16 U5.25
A3
  Top 0.203: J7.4 J3.4 60.96,10.16 U5.26
A4/SDA
  Top 0.203: J7.5 J3.5 63.5,10.16 U5.27
A5/SCL
  Top 0.203: J7.6 J3.6 66.04,10.16 U5.28
D0/RX  (via drill 0.51)
  Top 0.203: J2.1 J4.1 | R8.2 53.34,35.56 U5.2 | U3.2 8.38,9.4 9.53,8.26 v13.97,8.26
  Bottom 0.203: J2.1 60.96,35.56 63.5,33.02 U5.2 67.94,20.95 67.94,14.61 61.59,8.26 v13.97,8.26
D1/TX  (via drill 0.51)
  Top 0.203: J2.2 J4.2 | R9.2 53.34,33.02 U5.3 | U3.3 8.38,10.67 9.53,9.53 v13.97,9.53
  Bottom 0.203: J2.2 58.42,35.56 60.96,33.02 U5.3 67.31,19.05 67.31,15.24 61.59,9.53 v13.97,9.53
D2
  Top 0.203: J2.3 J4.3
  Bottom 0.203: U5.4 58.42,33.02 55.88,35.56 J2.3
D3
  Top 0.203: J2.4 J4.4
  Bottom 0.203: U5.5 55.88,33.02 53.34,35.56 J2.4
D4
  Top 0.203: J2.5 J4.5
  Bottom 0.203: U5.6 53.34,33.02 50.8,35.56 J2.5
D5
  Top 0.203: J2.6 J4.6
  Bottom 0.203: U5.11 40.64,27.94 48.26,35.56 J2.6
D6
  Top 0.203: J4.7 J2.7
  Bottom 0.203: U5.12 38.1,27.94 45.72,35.56 J2.7
D7
  Top 0.203: J4.8 J2.8
  Bottom 0.203: U5.13 35.56,27.94 43.18,35.56 J2.8
D8
  Top 0.203: J4.9 J2.9
  Bottom 0.203: U5.14 33.02,27.94 40.64,35.56 J2.9
D9
  Top 0.203: J4.10 J2.10
  Bottom 0.203: U5.15 31.75,17.78 30.48,19.05 30.48,27.94 38.1,35.56 J2.10
D10/SS
  Top 0.203: J4.11 J2.11
  Bottom 0.203: U5.16 35.56,16.51 34.92,15.88 32.38,15.88 29.84,18.41 29.84,29.84 35.56,35.56 J2.11
D11/MOSI
  Top 0.203: J4.12 J2.12
  Bottom 0.203: U5.17 38.1,16.51 36.83,15.24 31.75,15.24 29.21,17.78 29.21,31.75 33.02,35.56 J2.12
D12/MISO
  Top 0.203: J4.13 J2.13
  Bottom 0.203: U5.18 40.64,16.51 38.73,14.61 31.11,14.61 28.57,17.14 28.57,33.66 30.48,35.56 J2.13
D13/SCK
  Top 0.203: J4.14 J2.14 27.94,42.76 R10.2
  Bottom 0.203: U5.19 43.18,16.51 40.64,13.97 30.48,13.97 27.94,16.51 J2.14
D+
  Top 0.203: R5.2 7.62,22.35 5.97,24 USB.D+
D-
  Top 0.203: R6.2 9.53,22.61 7.48,24.65 USB.D-
GND
  pour Top (rank 2): -3.81,26.67 -3.81,-3.81 73.66,-3.81 73.66,52.07 -2.54,52.07 -3.81,52.07
  pour Bottom: -6.35,17.78 -6.35,-6.35 76.2,-6.35 76.2,54.61 -6.35,54.61
N$1
  Top 0.406: D1.C 18.79,43.16 C5.+
  Top 0.508: D1.C 22.61,39.88 24.77,37.72 24.77,30.61 23.57,29.41 U1.3
N$2  (via drill 0.51)
  other vias: 35.56,11.43
N$3
  Top 0.203: R3.2 ON.C
N$4
  Top 0.203: RX.A R8.1
N$5
  Top 0.203: TX.A R9.1
N$6
  Top 0.203: LED.A R10.1
N$7
  Top 0.203: R5.1 5.08,17.57 5.08,14.35 6.22,13.21 U3.5
N$8
  Top 0.203: U3.6 6.35,14.48 5.71,15.11 5.71,17.14 7.11,18.54 8.89,18.54 9.53,19.18 R6.1
N$9
  Top 0.203: U3.8 7.93,17.68 Y3.3 11.43,18.56 C2.1
N$10
  Top 0.203: U5.9 47.41,27.09 C13.1 46.53,30.09 Y1.1
N$11
  Top 0.203: U3.7 8,15.75 10.71,13.04 C1.1 11.43,14.46 Y3.1
N$12
  Top 0.203: U3.4 8.38,11.94 10.16,10.16 12.99,10.16 C10.1
N$13
  Top 0.203: U5.10 41.49,27.09 C14.1 42.4,29.21 Y1.3
N$14
  Top 0.203: R1.2 15.28,35.61 U1.4
  pour Top: 13.97,34.8 16.51,34.8 18.29,33.02 22.86,33.02 22.86,37.47 13.97,37.47
N$15
  Top 0.203: R1.1 15.24,32.64 | 15.24,32.64 R2.2 | U1.1 18.01,31.65 17.02,32.64 15.24,32.64
N$16  (via drill 0.51)
  other vias: 36.83,11.43
N$17
  Top 0.203: C8.1 6.35,4.23 6.35,5.08 4.45,6.99 1.27,6.99 0.64,7.62 0.64,11.43 1.14,11.94 U3.13
N$18  (via drill 0.51)
  other vias: 38.1,11.43
N$19  (via drill 0.51)
  other vias: 25.4,19.05
N$20  (via drill 0.51)
  other vias: 25.4,17.78
N$21  (via drill 0.51)
  other vias: 25.4,16.51
N$22  (via drill 0.51)
  other vias: 20.32,11.43
N$23  (via drill 0.51)
  other vias: 21.59,11.43
N$24  (via drill 0.51)
  other vias: 22.86,11.43
N$25  (via drill 0.51)
  other vias: 2.54,30.48
N$26  (via drill 0.51)
  other vias: 3.81,30.48
N$27  (via drill 0.51)
  other vias: 25.4,25.4
N$28  (via drill 0.51)
  other vias: 25.4,26.67
N$29  (via drill 0.51)
  other vias: 25.4,27.94
N$30  (via drill 0.51)
  other vias: 64.77,40.64
N$31  (via drill 0.51)
  other vias: 64.77,39.37
N$32  (via drill 0.51)
  other vias: 64.77,38.1
RESET  (via drill 0.51)
  Top 0.203: C8.2 10.38,1.91 RESET.2 RESET.1 19.68,1.91 v20.32,2.54 | U5.1 R7.1
  Bottom 0.203: U5.1 68.58,22.86 68.58,13.97 63.5,8.89 63.5,2.03 62.23,0.76 28.45,0.76 J5.1 | J6.1 J5.1 | v20.32,2.54 J5.1
VBUS
  Top 0.406: USB.VBUS 5.61,25.3 7.23,26.92 F2.1
VIN
  Top 0.508: J1.PWR 14.21,39.88 D1.A
  Bottom 0.508: J1.PWR 11.05,36.72 11.05,9.27 13.21,7.11 43.69,7.11 44.45,6.35 J6.8 J5.8
VUSB
  Top 0.406: F2.2 10.54,27.94 C15.+ 11.94,24.26 13.02,23.18 14.61,21.59 18.27,21.59 Q1.1
  pour Top: 18.92,22.86 19.43,22.35 19.43,18.41 18.92,17.91 15.88,17.91 15.24,18.54 15.24,22.23 15.88,22.86

### Text on the board
tPlace: ~ | ~ | ~ | ~ | ~ | ~ | Arikayaaa | D13 | D12 | D11 | D10 | D9 | D8 | D7 | D6 | D5 | D4 | D3 | D2 | TX/D1 | RX/D0 | RESET | 3V3 | 3V3 | 5V | 5V | GND | GND | VIN | A0 | A1 | A2 | A3 | A4/SDA | A5/SCL
bPlace: SArduino V1.00